# EAGLE design BUZZI-45 (EAGLE 4.16)
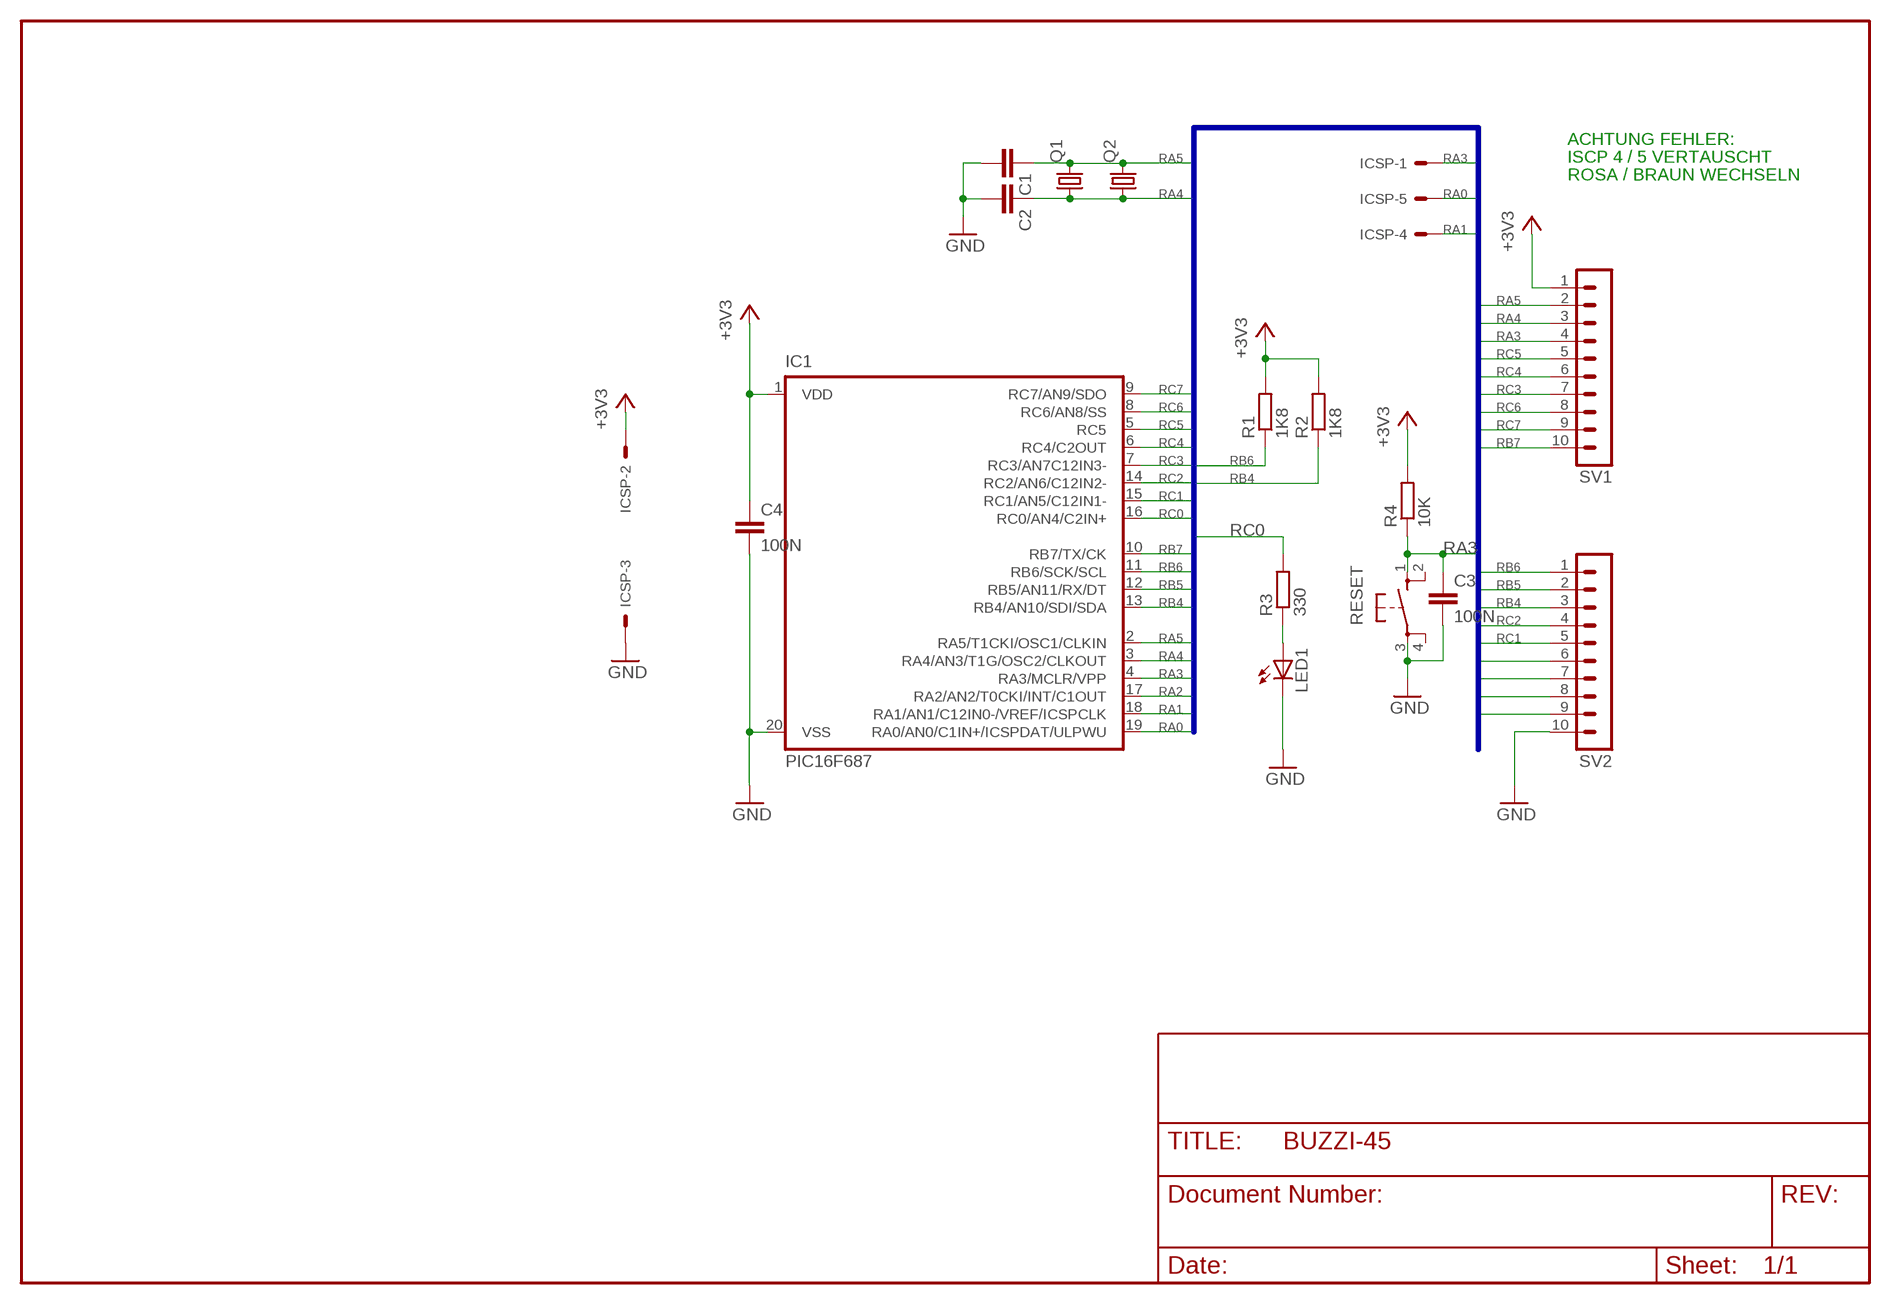
[diagram p0: schematic, sheet 1]

## Parts
C1  C-EUC0805  [C0805]
C2  C-EUC0805  [C0805]
C3  100N  C-EUC0805  [C0805]
C4  100N  C-EUC0805  [C0805]
IC1  PIC16F687  [SSOP20]
ICSP  53047-06  [53047-06]
LED1  LEDCHIP-LED0805  [CHIP-LED0805]
Q1  CRYTALHC49S  [HC49/S]
Q2  CRYTALTC26V  [TC26V]
R1  1K8  R-EU_M0805  [M0805]
R2  1K8  R-EU_M0805  [M0805]
R3  330  R-EU_M0805  [M0805]
R4  10K  R-EU_M0805  [M0805]
RESET  10XX  [B3F-10XX]
SV1  MA10-1  [MA10-1]
SV2  MA10-1  [MA10-1]

## Nets
+3V3: C4.1 IC1.1(VDD) ICSP.2 R1.2 R2.2 R4.2 SV1.1
GND: C1.2 C2.2 C3.2 C4.2 IC1.20(VSS) ICSP.3 LED1.C RESET.3 SV2.10
N$1: LED1.A R3.1
RA0: IC1.19(RA0/AN0/C1IN+/ICSPDAT/ULPWU) ICSP.5 SV2.9
RA1: IC1.18(RA1/AN1/C12IN0-/VREF/ICSPCLK) ICSP.4 SV2.8
RA2: IC1.17(RA2/AN2/T0CKI/INT/C1OUT) SV2.7
RA3: C3.1 IC1.4(RA3/MCLR/VPP) ICSP.1 R4.1 RESET.1 SV1.4
RA4: C2.1 IC1.3(RA4/AN3/T1G/OSC2/CLKOUT) Q1.1 Q2.1 SV1.3
RA5: C1.1 IC1.2(RA5/T1CKI/OSC1/CLKIN) Q1.2 Q2.2 SV1.2
RB4: IC1.13(RB4/AN10/SDI/SDA) R2.1 SV2.3
RB5: IC1.12(RB5/AN11/RX/DT) SV2.2
RB6: IC1.11(RB6/SCK/SCL) R1.1 SV2.1
RB7: IC1.10(RB7/TX/CK) SV1.10
RC0: IC1.16(RC0/AN4/C2IN+) R3.2 SV2.6
RC1: IC1.15(RC1/AN5/C12IN1-) SV2.5
RC2: IC1.14(RC2/AN6/C12IN2-) SV2.4
RC3: IC1.7(RC3/AN7C12IN3-) SV1.7
RC4: IC1.6(RC4/C2OUT) SV1.6
RC5: IC1.5(RC5) SV1.5
RC6: IC1.8(RC6/AN8/SS) SV1.8
RC7: IC1.9(RC7/AN9/SDO) SV1.9
Unconnected: ICSP.6 RESET.2 RESET.4

## Buses
RA[0..5],RB[4..7],RC[0..7]

## Notes on the sheet
- ACHTUNG FEHLER:
- ISCP 4 / 5 VERTAUSCHT
- ROSA / BRAUN WECHSELN

## Library data of the parts
C1-C4 = turbod3:C-EU: CAPACITOR, European symbol
IC1 = microchip-5:PIC16F687*: MICROCONTROLLER PIC16F687 18 I/O One 16-bit timer One 8-bit timer Two comparators Precision internal oscillator-software selectable 8 MHz - 32 KHz SSP w/ I2C Compatible Address mask option EUSART LIN 2.0 Compatible 12 A/D Channels ULPW Enhanced Low Power Timer 1 Timer 1 Gate Synch Latch 2k Program Flash memory 128 bytes SRAM 256 bytes EEPROM
ICSP = con-molex:53?-06: CONNECTOR wire to board 1.25 mm (.049 inch) pitch header
LED1 = led:LED: LED OSRAM: - CHIPLED LG R971, LG N971, LY N971, LG Q971, LY Q971, LO R971, LY R971 LH N974, LH R974 LS Q976, LO Q976, LY Q976 LO Q996 - Hyper CHIPLED LW Q18S LB Q993, LB Q99A, LB R99A - SideLED LS A670, LO A670, LY A670, LG A670, LP A670 LB A673, LV A673, LT A673, LW A673 LH A674 LY A675 LS A676, LA A676, LO A676, LY A676, LW A676 LS A679, LY A679, LG A679 - Hyper Micro SIDELED® LS Y876, LA Y876, LO Y876, LY Y876 LT Y87S - SmartLED LW L88C, LW L88S LB L89C, LB L89S, LG L890 LS L89K, LO L89K, LY L89K LS L896, LA L896, LO L896, LY L896 - TOPLED LS T670, LO T670, LY T670, LG T670, LP T670 LSG T670, LSP T670, LSY T670, LOP T670, LYG T670 LG T671, LOG T671, LSG T671 LB T673, LV T673, LT T673, LW T673 LH T674 LS T676, LA T676, LO T676, LY T676, LB T676, LH T676, LSB T676, LW T676 LB T67C, LV T67C, LT T67C, LS T67K, LO T67K, LY T67K, LW E67C LS E67B, LA E67B, LO E67B, LY E67B, LB E67C, LV E67C, LT E67C LW T67C LS T679, LY T679, LG T679 LS T770, LO T770, LY T770, LG T770, LP T770 LB T773, LV T773, LT T773, LW T773 LH T774 LS E675, LA E675, LY E675, LS T675 LS T776, LA T776, LO T776, LY T776, LB T776 LHGB T686 LT T68C, LB T68C - Hyper Mini TOPLED® LB M676 - Mini TOPLED Santana® LG M470 LS M47K, LO M47K, LY M47K Source: http://www.osram.convergy.de/
Q1 Q2 = turbod3:CRYTAL: CRYSTAL
R1-R4 = turbod3:R-EU_: RESISTOR, European symbol
RESET = KEY_B:10XX
SV1 SV2 = con-lstb:MA10-1: PIN HEADER

## Board
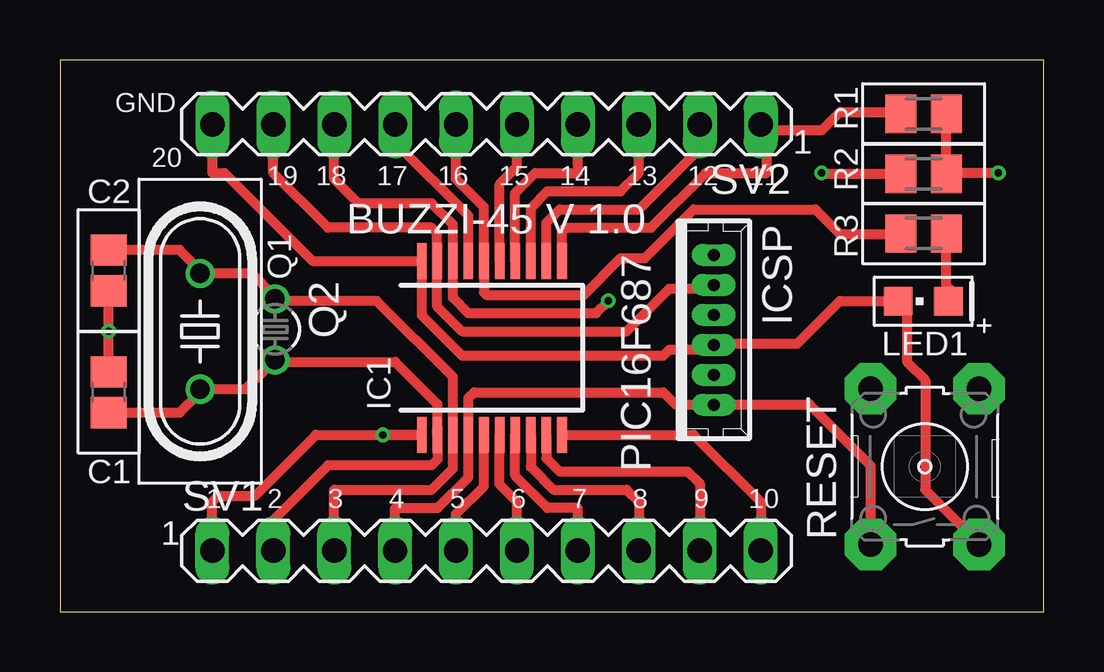
[diagram p1: board, top side]
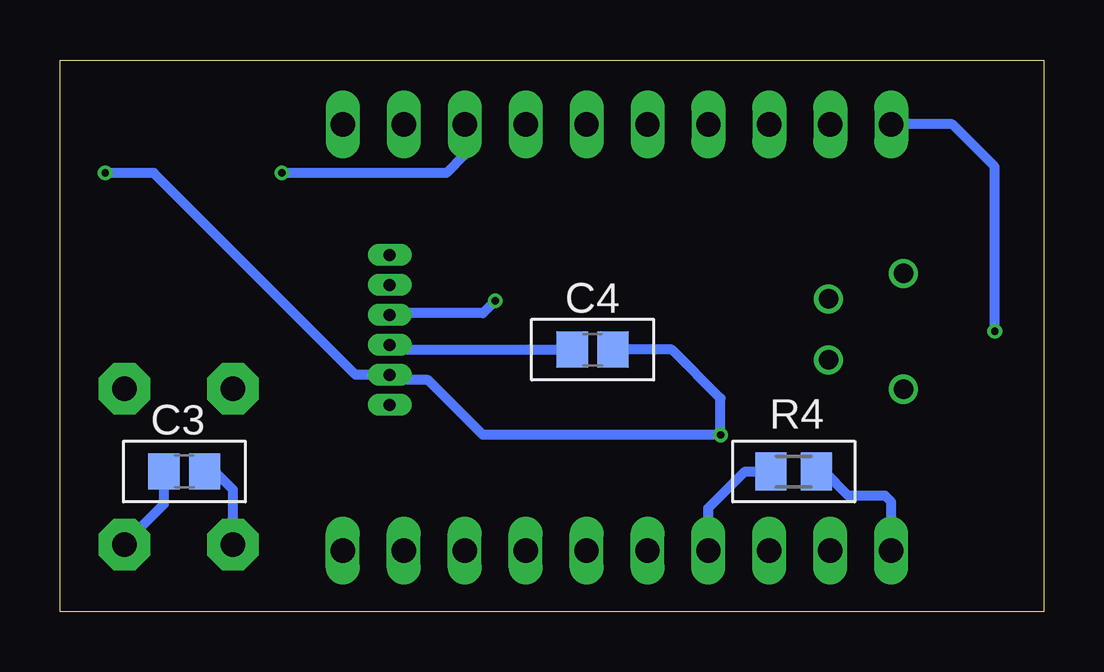
[diagram p2: board, bottom side, seen from below]

Size 41 x 23 mm. Coordinates in mm from the lower left corner, seen from the top.
Outline: 0,0 41,0 41,23 0,23 0,0
Copper layers (1*16): Top 0.035mm / dielectric 1.5mm / Bottom 0.035mm
Design rules "PCB-POOL": minimum track width 6mil, minimum drill 12mil, track to track 6mil, track to pad 6mil, pad to pad 6mil, via to via 6mil, smd to smd 6mil, copper to edge 20mil, drill to drill 8mil, minimum pad ring 8mil, minimum via ring 6mil, stop-mask expansion 3mil, vias tented up to drill 0mil, thermal gap 8mil

### Footprints (pad centres in the part's own frame; a part is rotated, then mirrored left to right if it is on the bottom)
C0805 = smd 1.3 x 1.5: 1 -0.85,0; 2 0.85,0
SSOP20 = smd 0.4 x 1.5: 1 -2.925,-3.625; 2 -2.275,-3.625; 3 -1.625,-3.625; 4 -0.975,-3.625; 5 -0.325,-3.625; 6 0.325,-3.625; 7 0.975,-3.625; 8 1.625,-3.625; 9 2.275,-3.625; 10 2.925,-3.625; 11 2.925,3.625; 12 2.275,3.625; 13 1.625,3.625; 14 0.975,3.625; 15 0.325,3.625; 16 -0.325,3.625; 17 -0.975,3.625; 18 -1.625,3.625; 19 -2.275,3.625; 20 -2.925,3.625
53047-06 = drill 0.5 pad 0.698 long: 1 3.125,0; 2 1.875,0; 3 0.625,0; 4 -0.625,0; 5 -1.875,0; 6 -3.125,0
CHIP-LED0805 = smd 1.2 x 1.2: A 0,-1.05; C 0,1.05
HC49/S = drill 0.813 round: 1 -2.413,0; 2 2.413,0
TC26V = drill 0.813 round: 1 -1.27,0; 2 1.27,0
M0805 = smd 1.3 x 1.6: 1 -0.95,0; 2 0.95,0
B3F-10XX = drill 1.016 pad 2.159 octagon: 1 -3.379,2.312; 2 3.123,2.312; 3 -3.379,-2.209; 4 3.123,-2.209
MA10-1 = drill 1.016 long: 1 -11.43,0; 2 -8.89,0; 3 -6.35,0; 4 -3.81,0; 5 -1.27,0; 6 1.27,0; 7 3.81,0; 8 6.35,0; 9 8.89,0; 10 11.43,0

### Placement (x,y rotation side)
C1  2.03,9.14 90 top
C2  2.03,14.22 270 top
C3  35.81,5.84 180 bottom
C4  18.8,10.92 180 bottom
IC1  18,11 0 top
ICSP  27.25,11.75 270 top
LED1  35.98,12.94 90 top
Q1  5.84,11.68 270 top
Q2  8.97,11.76 270 top
R1  36,20.75 0 top
R2  36,18.25 0 top
R3  36,15.76 180 top
R4  10.41,5.84 0 bottom
RESET  36.1,6.17 90 top
SV1  17.78,2.54 0 top
SV2  17.78,20.32 180 top

### Tracks (layer width: path | path; a pad name or v marks a point on that pad's centre or on a via)
+3V3  (via drill 0.3)
  Top 0.406: SV1.1 6.6,2.54 6.35,2.79 6.35,4.57 6.6,4.83 8.13,4.83 10.68,7.38 IC1.1 v13.47,7.38 v13.46,7.37 | R2.2 36.95,18.17 37.08,18.03 | R2.2 R1.2 | R2.2 37.08,18.39 37.08,18.29 v39.12,18.29
  Bottom 0.406: v39.12,18.29 37.08,18.29 28.67,9.87 ICSP.2 27.21,9.87 27.18,9.91 26.92,9.65 25.65,9.65 23.37,7.37 v13.46,7.37 13.46,8.89 15.49,10.92 C4.1 | R4.2 9.14,5.84 8.13,4.83 6.6,4.83 6.35,4.57 SV1.1
GND  (via drill 0.3)
  Top 0.406: 2.03,9.91 C1.2 v2.03,11.68 C2.2 | SV2.10 6.35,18.29 6.86,18.29 10.52,14.62 IC1.20 15.07,12.36 16.76,10.67 25.15,10.67 25.4,10.92 26.92,10.92 27.18,11.18 27.23,11.12 ICSP.3 27.31,11.18 30.73,11.18 32.51,12.95 34.8,12.95 34.82,12.94 LED1.C 34.95,12.95 35.31,12.95 35.31,10.41 36.07,9.65 36.07,5.08 38.35,2.79 RESET.3
  Bottom 0.406: SV2.10 3.81,20.32 2.03,18.54 v2.03,11.68 | ICSP.3 27.23,11.12 27.18,11.18 26.92,10.92 C4.2 | RESET.3 38.35,2.79 36.66,4.48 C3.2
N$1
  Top 0.406: 37.29,13.26 37.34,13.21 | LED1.A 37.29,13.26 | R3.1 36.95,13.6 37.29,13.26
RA0
  Top 0.406: SV2.9 8.89,18.29 11.18,16 15.49,16 15.72,15.77 IC1.19 15.72,12.72 16.76,11.68 23.62,11.68 25.4,13.46 26.92,13.46 27.18,13.72 27.25,13.64 ICSP.5
RA1  (via drill 0.3)
  Top 0.406: SV2.8 11.43,18.03 12.45,17.02 15.49,17.02 16.38,16.14 IC1.18 16.38,13.09 17.02,12.45 22.35,12.45 v22.86,12.95
  Bottom 0.406: v22.86,12.95 23.37,12.45 27.18,12.45 ICSP.4
RA2
  Top 0.406: IC1.17 17.02,16.5 13.97,19.56 13.97,20.07 13.72,20.32 SV2.7
RA3
  Top 0.406: SV1.4 13.97,4.32 15.75,4.32 17.02,5.59 IC1.4 17.02,8.9 17.27,9.14 25.15,9.14 25.65,8.64 27.18,8.64 27.19,8.62 ICSP.1 27.42,8.62 27.43,8.64 31.24,8.64 33.79,6.09 RESET.1
  Bottom 0.406: C3.1 34.54,5.84 33.78,5.08 RESET.1 | R4.1 12.45,5.84 13.97,4.32 SV1.4 13.97,2.29
RA4
  Top 0.406: C2.1 4.99,15.07 5.84,14.22 Q1.1 8,14.1 8.89,13.21 | 8.89,13.21 8.97,13.13 Q2.1 | 8.89,13.21 9.14,12.95 13.21,12.95 16.38,9.79 IC1.3 16.38,5.96 15.49,5.08 11.43,5.08 SV1.3 11.43,2.29
RA5
  Top 0.406: C1.1 4.99,8.29 5.84,9.14 Q1.2 7.75,9.27 8.89,10.41 | 8.89,10.41 Q2.2 | 8.89,10.41 13.97,10.41 15.72,8.66 IC1.2 15.72,7.6 15.75,7.62 15.75,6.35 15.49,6.1 11.18,6.1 8.89,3.81 SV1.2
RB4  (via drill 0.3)
  Top 0.406: IC1.13 19.62,16.83 20.32,17.53 23.37,17.53 24.13,18.29 SV2.3 | R2.1 31.78,18.25 v31.75,18.29
  Bottom 0.406: v31.75,18.29 24.89,18.29 24.13,19.05 SV2.3
RB5
  Top 0.406: IC1.12 20.27,16.21 20.83,16.76 24.13,16.76 26.67,19.3 SV2.2
RB6
  Top 0.406: IC1.11 20.93,15.85 21.08,16 24.64,16 26.92,18.29 29.46,18.29 29.46,20.07 | 29.46,20.07 SV2.1 | 35.05,20.83 | 35.05,20.83 R1.1 | 29.46,20.07 31.75,20.07 32.51,20.83 35.05,20.83
RB7
  Top 0.406: IC1.10 26.41,7.38 29.21,4.57 SV1.10 29.21,2.29
RC0
  Top 0.406: SV2.6 16.51,18.03 17.68,16.87 IC1.16 17.68,13.31 17.78,13.21 21.84,13.21 23.37,14.73 24.38,14.73 26.42,16.76 31.5,16.76 32.51,15.75 35.05,15.75 R3.2
RC1
  Top 0.406: IC1.15 18.32,17.82 19.05,18.54 SV2.5
RC2
  Top 0.406: IC1.14 18.98,17.45 19.81,18.29 21.59,18.29 SV2.4
RC3
  Top 0.406: IC1.7 18.98,5.66 20.32,4.32 21.59,4.32 SV1.7
RC4
  Top 0.406: IC1.6 18.32,5.3 19.05,4.57 SV1.6
RC5
  Top 0.406: IC1.5 17.68,5.23 16.51,4.06 SV1.5
RC6
  Top 0.406: IC1.8 19.62,6.03 20.57,5.08 23.62,5.08 24.13,4.57 SV1.8
RC7
  Top 0.406: IC1.9 20.27,6.39 20.83,5.84 26.16,5.84 26.67,5.33 SV1.9

### Text on the board
tNames: GND | 20 | 19 | 18 | 17 | 16 | 15 | 14 | 13 | 12 | 11 | BUZZI-45 V 1.0 | PIC16F687 | 1 | 2 | 3 | 4 | 5 | 6 | 7 | 8 | 9 | 10